# EAGLE design Raspberry-Pi-Header (EAGLE 9.6.2)
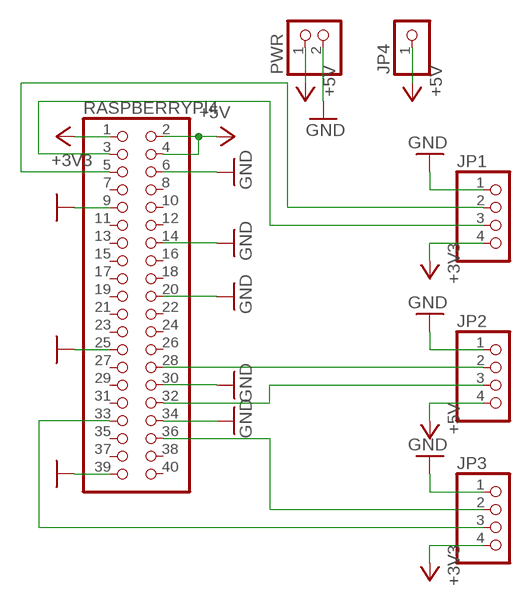
[diagram p0: schematic, sheet 1]

## Parts
JP1  PINHD-1X4/90  [1X04/90]
JP2  PINHD-1X4/90  [1X04/90]
JP3  PINHD-1X4/90  [1X04/90]
JP4  PINHD-1X1  [1X01]
PWR  PINHD-1X2/90  [1X02/90]
RASPBERRYPI4  PINHD-2X20  [2X20]

## Nets
+3V3: JP1.4 JP3.4 RASPBERRYPI4.1
+5V: JP2.4 JP4.1 PWR.1 RASPBERRYPI4.2 RASPBERRYPI4.4
GND: JP1.1 JP2.1 JP3.1 PWR.2 RASPBERRYPI4.6 RASPBERRYPI4.9 RASPBERRYPI4.14 RASPBERRYPI4.20 RASPBERRYPI4.25 RASPBERRYPI4.30 RASPBERRYPI4.34 RASPBERRYPI4.39
GPIO1: JP2.2 RASPBERRYPI4.28
GPIO12: JP2.3 RASPBERRYPI4.32
GPIO13: JP3.3 RASPBERRYPI4.33
GPIO16: JP3.2 RASPBERRYPI4.36
SCL: JP1.2 RASPBERRYPI4.5
SDA: JP1.3 RASPBERRYPI4.3
Unconnected: RASPBERRYPI4.7 RASPBERRYPI4.8 RASPBERRYPI4.10 RASPBERRYPI4.11 RASPBERRYPI4.12 RASPBERRYPI4.13 RASPBERRYPI4.15 RASPBERRYPI4.16 RASPBERRYPI4.17 RASPBERRYPI4.18 RASPBERRYPI4.19 RASPBERRYPI4.21 RASPBERRYPI4.22 RASPBERRYPI4.23 RASPBERRYPI4.24 RASPBERRYPI4.26 RASPBERRYPI4.27 RASPBERRYPI4.29 RASPBERRYPI4.31 RASPBERRYPI4.35 RASPBERRYPI4.37 RASPBERRYPI4.38 RASPBERRYPI4.40

## Library data of the parts
JP1-JP3 = pinhead:PINHD-1X4: PIN HEADER
JP4 = pinhead:PINHD-1X1: PIN HEADER
PWR = pinhead:PINHD-1X2: PIN HEADER
RASPBERRYPI4 = pinhead:PINHD-2X20: PIN HEADER

## Board
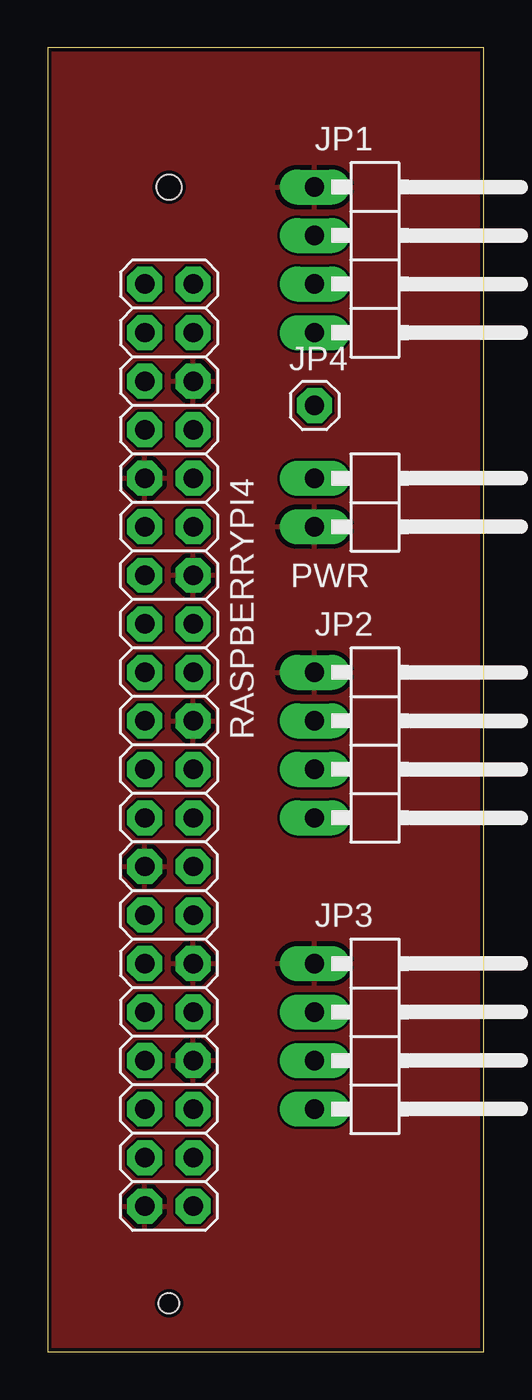
[diagram p1: board, top side]
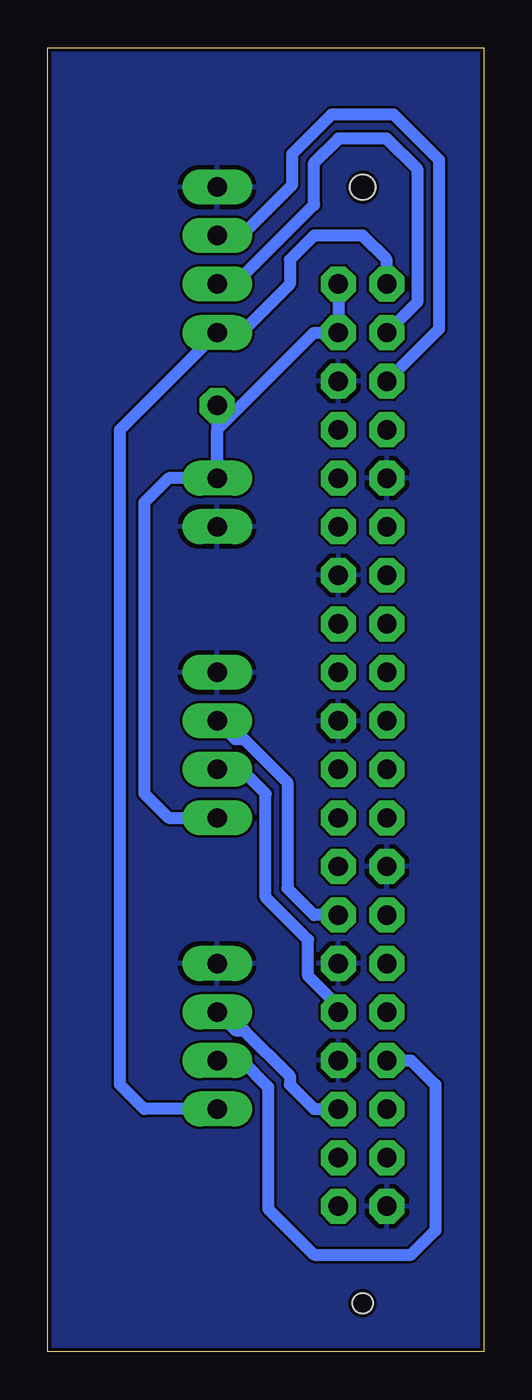
[diagram p2: board, bottom side, seen from below]

Size 22.84 x 68.25 mm. Coordinates in mm from the lower left corner, seen from the top.
Outline: 0,0 22.84,0 22.84,68.25 0,68.25 0,0
Copper layers (1*16): Top 0.035mm / dielectric 1.6mm / Bottom 0.035mm
Design rules "jlcpcb-2layers": minimum track width 5mil, minimum drill 0.3mm, track to track 5mil, track to pad 5mil, pad to pad 5mil, via to via 5mil, smd to smd 5mil, copper to edge 0.2mm, drill to drill 6mil, minimum pad ring 10mil, minimum via ring 3mil, stop-mask expansion 4mil, vias tented up to drill 0mil, thermal gap 10mil
Holes 1.07 mm at 6.35,2.54
Holes 1.32 mm at 6.35,60.96

### Footprints (pad centres in the part's own frame; a part is rotated, then mirrored left to right if it is on the bottom)
1X04/90 = drill 1.016 long: 1 -3.81,-3.81; 2 -1.27,-3.81; 3 1.27,-3.81; 4 3.81,-3.81
1X01 = drill 1.016 octagon: 1 0,0
1X02/90 = drill 1.016 long: 1 -1.27,-3.81; 2 1.27,-3.81
2X20 = drill 1.016 octagon: 1 -24.13,-1.27; 2 -24.13,1.27; 3 -21.59,-1.27; 4 -21.59,1.27; 5 -19.05,-1.27; 6 -19.05,1.27; 7 -16.51,-1.27; 8 -16.51,1.27; 9 -13.97,-1.27; 10 -13.97,1.27; 11 -11.43,-1.27; 12 -11.43,1.27; 13 -8.89,-1.27; 14 -8.89,1.27; 15 -6.35,-1.27; 16 -6.35,1.27; 17 -3.81,-1.27; 18 -3.81,1.27; 19 -1.27,-1.27; 20 -1.27,1.27; 21 1.27,-1.27; 22 1.27,1.27; 23 3.81,-1.27; 24 3.81,1.27; 25 6.35,-1.27; 26 6.35,1.27; 27 8.89,-1.27; 28 8.89,1.27; 29 11.43,-1.27; 30 11.43,1.27; 31 13.97,-1.27; 32 13.97,1.27; 33 16.51,-1.27; 34 16.51,1.27; 35 19.05,-1.27; 36 19.05,1.27; 37 21.59,-1.27; 38 21.59,1.27; 39 24.13,-1.27; 40 24.13,1.27

### Placement (x,y rotation side)
JP1  17.78,57.15 270 top
JP2  17.78,31.75 270 top
JP3  17.78,16.51 270 top
JP4  13.97,49.53 0 top
PWR  17.78,44.45 270 top
RASPBERRYPI4  6.35,31.75 270 top

### Tracks (layer width: path | path; a pad name or v marks a point on that pad's centre or on a via)
+3V3
  Bottom 0.635: RASPBERRYPI4.1 5.08,57.15 6.35,58.42 8.89,58.42 10.16,57.15 10.16,55.88 12.7,53.34 JP1.4 19.05,48.26 19.05,13.97 17.78,12.7 JP3.4
+5V
  Bottom 0.635: RASPBERRYPI4.2 RASPBERRYPI4.4 8.89,53.34 13.97,48.26 PWR.1 | JP4.1 PWR.1 | JP2.4 16.51,27.94 17.78,29.21 17.78,44.45 16.51,45.72 PWR.1
GND
  pour Bottom: 0,68.58 0,0 22.86,0 22.86,68.58
  pour Top: 0,68.58 0,0 22.86,0 22.86,68.58
GPIO1
  Bottom 0.635: RASPBERRYPI4.28 8.89,22.86 10.29,24.26 10.29,29.8 12.55,32.07 13.02,32.07 JP2.2
GPIO12
  Bottom 0.635: JP2.3 12.7,30.48 11.43,29.21 11.43,23.78 9.21,21.56 9.21,19.66 7.62,18.07 RASPBERRYPI4.32
GPIO13
  Bottom 0.635: RASPBERRYPI4.33 3.81,15.24 2.54,13.97 2.54,6.35 3.81,5.08 8.89,5.08 11.3,7.49 11.3,13.84 12.7,15.24 JP3.3
GPIO16
  Bottom 0.635: JP3.2 13.02,16.83 12.55,16.83 10.16,14.44 10.16,13.97 8.89,12.7 RASPBERRYPI4.36
SCL
  Bottom 0.635: JP1.2 12.7,58.42 10.03,61.09 10.03,62.7 7.97,64.77 4.73,64.77 2.35,62.39 2.35,53.53 RASPBERRYPI4.5
SDA
  Bottom 0.635: JP1.3 13.05,55.88 8.89,60.04 8.89,62.23 7.62,63.5 5.08,63.5 3.49,61.91 3.49,54.93 RASPBERRYPI4.3